# Altium schematic sheet Oled.SchDoc
size A2
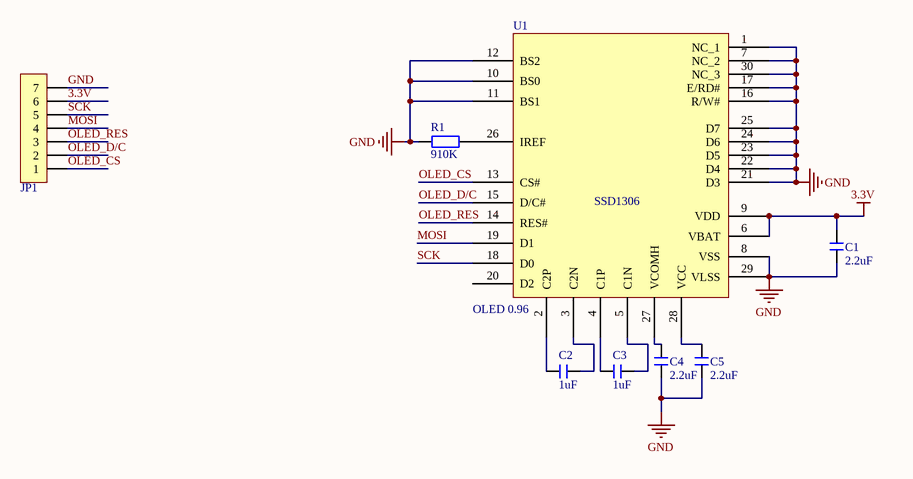
[diagram p0: Oled.SchDoc]

## Parts
C1  2.2uF  [C 0603]
C2  1uF  [C 0603]
C3  1uF  [C 0603]
C4  2.2uF  [C 0603]
C5  2.2uF  [C 0603]
JP1  HDR-1X7  [HDR2.54 ST 1x7 H]  (value not drawn)
R1  910K  [R 0603]
U1  OLED 0.96  [OLED 0.96 - TWO]

## Nets
3.3V: C1.2 JP1.6 U1.6(VBAT) U1.9(VDD)
GND: C1.1 C4.1 C5.1 JP1.7 R1.1 U1.1(NC_1) U1.7(NC_2) U1.8(VSS) U1.10(BS0) U1.11(BS1) U1.12(BS2) U1.16(R/W#) U1.17(E/RD#) U1.21(D3) U1.22(D4) U1.23(D5) U1.24(D6) U1.25(D7) U1.29(VLSS) U1.30(NC_3)
MOSI: JP1.4 U1.19(D1)
OLED_CS: JP1.1 U1.13(CS#)
OLED_D/C: JP1.2 U1.15(D/C#)
OLED_RES: JP1.3 U1.14(RES#)
SCK: JP1.5 U1.18(D0)
NetC2_1: C2.1 U1.2(C2P)
NetC2_2: C2.2 U1.3(C2N)
NetC3_1: C3.1 U1.4(C1P)
NetC3_2: C3.2 U1.5(C1N)
NetC4_2: C4.2 U1.27(VCOMH)
NetC5_2: C5.2 U1.28(VCC)
NetR1_2: R1.2 U1.26(IREF)

Not connected (* = marked no-connect by the designer): U1 20(D2)

## Notes on the sheet
- (in symbol OLED 0.96) SSD1306

## Library data of the parts
C1-C5 = C: 无极性贴片电容; 版权归属: 黎明电子style; BOM名称: 无极性贴片电容; 学习资源: https://lmdzstyle.taobao.com/
JP1 = Header 7: 7P接插件; 版权归属: 黎明电子style; BOM名称: 7P接插件; 学习资源: https://lmdzstyle.taobao.com/
R1 = R: 贴片电阻; 版权归属: 黎明电子style; BOM名称: 贴片电阻; 学习资源: https://lmdzstyle.taobao.com/